# EAGLE design Quad-Thermocouple-Shield (EAGLE 6.1)
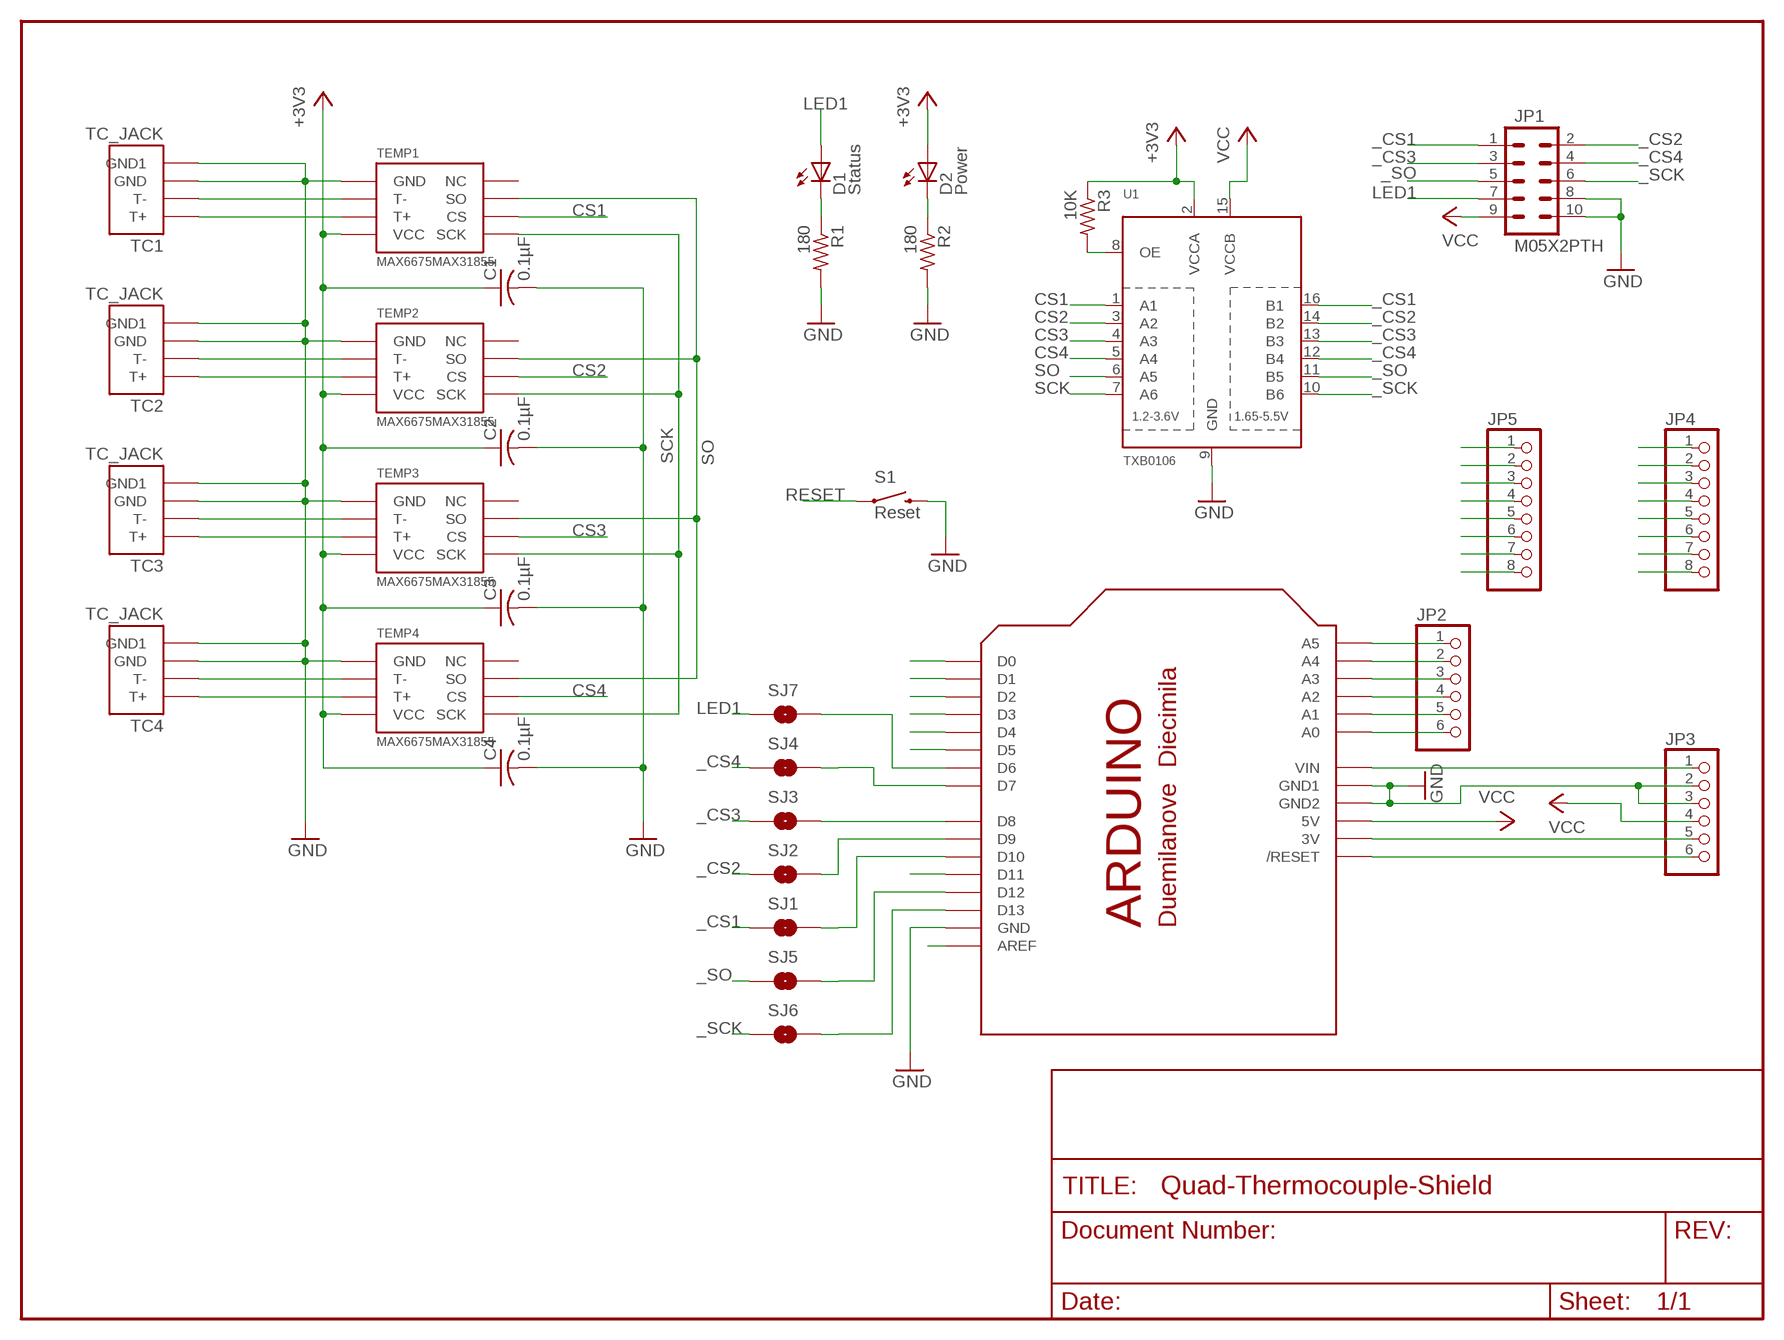
[diagram p0: schematic, sheet 1]

## Parts
C1  0.1µF  C-USC0603  [C0603]
C2  0.1µF  C-USC0603  [C0603]
C3  0.1µF  C-USC0603  [C0603]
C4  0.1µF  C-USC0603  [C0603]
D1  Status  LEDCHIPLED_0805  [CHIPLED_0805]
D2  Power  LEDCHIPLED_0805  [CHIPLED_0805]
JP1  M05X2PTH  [AVR_ICSP]
JP2  PINHD-1X6CB  [1X06-CLEANBIG]
JP3  PINHD-1X6CB  [1X06-CLEANBIG]
JP4  PINHD-1X8CLEANBIG  [1X08-CLEANBIG]
JP5  PINHD-1X8CLEANBIG  [1X08-CLEANBIG]
R1  180  R-US_R0603  [R0603]
R2  180  R-US_R0603  [R0603]
R3  10K  R-US_R0603  [R0603]
S1  Reset  SWITCH-MOMENTARY-2SMD  [TACTILE_SWITCH_SMD]
SJ1  SOLDERJUMPERTRACE  [SJ_2S-TRACE]
SJ2  SOLDERJUMPERTRACE  [SJ_2S-TRACE]
SJ3  SOLDERJUMPERTRACE  [SJ_2S-TRACE]
SJ4  SOLDERJUMPERTRACE  [SJ_2S-TRACE]
SJ5  SOLDERJUMPERTRACE  [SJ_2S-TRACE]
SJ6  SOLDERJUMPERTRACE  [SJ_2S-TRACE]
SJ7  SOLDERJUMPERTRACE  [SJ_2S-TRACE]
TC1  TC_JACK  [TC_JACK]
TC2  TC_JACK  [TC_JACK]
TC3  TC_JACK  [TC_JACK]
TC4  TC_JACK  [TC_JACK]
TEMP1  MAX6675MAX31855  [SOIC-8]
TEMP2  MAX6675MAX31855  [SOIC-8]
TEMP3  MAX6675MAX31855  [SOIC-8]
TEMP4  MAX6675MAX31855  [SOIC-8]
U1  TXB0106  TXB0106PWR  [TSSOP16]
U$3  ARDUINOUNO  [ARDUINO]

## Nets
+3V3: C1.1 C2.1 C3.1 C4.1 D2.A JP3.5 R3.1 TEMP1.VCC TEMP2.VCC TEMP3.VCC TEMP4.VCC U1.2(VCCA) U$3.3V
_CS1: JP1.1 SJ1.1 U1.16(B1)
_CS2: JP1.2 SJ2.1 U1.14(B2)
_CS3: JP1.3 SJ3.1 U1.13(B3)
_CS4: JP1.4 SJ4.1 U1.12(B4)
_SCK: JP1.6 SJ6.1 U1.10(B6)
_SO: JP1.5 SJ5.1 U1.11(B5)
AREF: JP4.8 U$3.AREF
CS1: TEMP1.CS U1.1(A1)
CS2: TEMP2.CS U1.3(A2)
CS3: TEMP3.CS U1.4(A3)
CS4: TEMP4.CS U1.5(A4)
D0: JP5.1 U$3.D0
D1: JP5.2 U$3.D1
D2: JP5.3 U$3.D2
D3: JP5.4 U$3.D3
D4: JP5.5 U$3.D4
D5: JP5.6 U$3.D5
D6: JP5.7 SJ7.2 U$3.D6
D7: JP5.8 SJ4.2 U$3.D7
D8: JP4.1 SJ3.2 U$3.D8
D9: JP4.2 SJ2.2 U$3.D9
D10: JP4.3 SJ1.2 U$3.D10
D11: JP4.4 U$3.D11
D12: JP4.5 SJ5.2 U$3.D12
D13: JP4.6 SJ6.2 U$3.D13
GND: C1.2 C2.2 C3.2 C4.2 JP1.8 JP1.10 JP3.2 JP3.3 JP4.7 R1.2 R2.2 S1.3 TC1.P$1(GND) TC1.P$2(GND1) TC2.P$1(GND) TC2.P$2(GND1) TC3.P$1(GND) TC3.P$2(GND1) TC4.P$1(GND) TC4.P$2(GND1) TEMP1.GND TEMP2.GND TEMP3.GND TEMP4.GND U1.9(GND) U$3.GND U$3.GND1 U$3.GND2
LED1: D1.A JP1.7 SJ7.1
N$2: D1.C R1.1
N$3: JP2.1 U$3.A5
N$6: JP2.2 U$3.A4
N$7: D2.C R2.1
N$9: JP2.3 U$3.A3
N$12: JP2.4 U$3.A2
N$114: R3.2 U1.8(OE)
N$126: JP2.5 U$3.A1
N$127: JP2.6 U$3.A0
N$128: JP3.1 U$3.VIN
RESET: JP3.6 S1.1 U$3.RESET(/RESET)
SCK: TEMP1.SCK TEMP2.SCK TEMP3.SCK TEMP4.SCK U1.7(A6)
SO: TEMP1.SO TEMP2.SO TEMP3.SO TEMP4.SO U1.6(A5)
T1+: TC1.T+ TEMP1.T+
T1-: TC1.T- TEMP1.T-
T2+: TC2.T+ TEMP2.T+
T2-: TC2.T- TEMP2.T-
T3+: TC3.T+ TEMP3.T+
T3-: TC3.T- TEMP3.T-
T4+: TC4.T+ TEMP4.T+
T4-: TC4.T- TEMP4.T-
VCC: JP1.9 JP3.4 U1.15(VCCB) U$3.5V
Unconnected: TEMP1.NC TEMP2.NC TEMP3.NC TEMP4.NC

## Library data of the parts
C1-C4 = resistor:C-US: CAPACITOR, American symbol
D1 D2 = led:LED: LED OSRAM: - CHIPLED LG R971, LG N971, LY N971, LG Q971, LY Q971, LO R971, LY R971 LH N974, LH R974 LS Q976, LO Q976, LY Q976 LO Q996 - Hyper CHIPLED LW Q18S LB Q993, LB Q99A, LB R99A - SideLED LS A670, LO A670, LY A670, LG A670, LP A670 LB A673, LV A673, LT A673, LW A673 LH A674 LY A675 LS A676, LA A676, LO A676, LY A676, LW A676 LS A679, LY A679, LG A679 - Hyper Micro SIDELED® LS Y876, LA Y876, LO Y876, LY Y876 LT Y87S - SmartLED LW L88C, LW L88S LB L89C, LB L89S, LG L890 LS L89K, LO L89K, LY L89K LS L896, LA L896, LO L896, LY L896 - TOPLED LS T670, LO T670, LY T670, LG T670, LP T670 LSG T670, LSP T670, LSY T670, LOP T670, LYG T670 LG T671, LOG T671, LSG T671 LB T673, LV T673, LT T673, LW T673 LH T674 LS T676, LA T676, LO T676, LY T676, LB T676, LH T676, LSB T676, LW T676 LB T67C, LV T67C, LT T67C, LS T67K, LO T67K, LY T67K, LW E67C LS E67B, LA E67B, LO E67B, LY E67B, LB E67C, LV E67C, LT E67C LW T67C LS T679, LY T679, LG T679 LS T770, LO T770, LY T770, LG T770, LP T770 LB T773, LV T773, LT T773, LW T773 LH T774 LS E675, LA E675, LY E675, LS T675 LS T776, LA T776, LO T776, LY T776, LB T776 LHGB T686 LT T68C, LB T68C - Hyper Mini TOPLED® LB M676 - Mini TOPLED Santana® LG M470 LS M47K, LO M47K, LY M47K Source: http://www.osram.convergy.de LUXEON: - LUMILED® LXK2-PW12-R00, LXK2-PW12-S00, LXK2-PW14-U00, LXK2-PW14-V00 LXK2-PM12-R00, LXK2-PM12-S00, LXK2-PM14-U00 LXK2-PE12-Q00, LXK2-PE12-R00, LXK2-PE12-S00, LXK2-PE14-T00, LXK2-PE14-U00 LXK2-PB12-K00, LXK2-PB12-L00, LXK2-PB12-M00, LXK2-PB14-N00, LXK2-PB14-P00, LXK2-PB14-Q00 LXK2-PR12-L00, LXK2-PR12-M00, LXK2-PR14-Q00, LXK2-PR14-R00 LXK2-PD12-Q00, LXK2-PD12-R00, LXK2-PD12-S00 LXK2-PH12-R00, LXK2-PH12-S00 LXK2-PL12-P00, LXK2-PL12-Q00, LXK2-PL12-R00 Source: www.luxeon.com KINGBRIGHT: KA-3528ASYC Source: www.kingbright.com
JP1 = SparkFun:M05X2: Header 5x2 Standard 10-pin dual row 0.1" header. Commonly used with AVR-ISP. Use with Spark Fun Electronics SKU: PRT-00778
JP2 JP3 = adafruit:PINHD-1X6: PIN HEADER
JP4 JP5 = adafruit:PINHD-1X8: PIN HEADER
R1-R3 = resistor:R-US_: RESISTOR, American symbol
S1 = SparkFun:SWITCH-MOMENTARY-2
SJ1-SJ7 = SparkFun:SOLDERJUMPER: Solder Jumper Standard SMD solder jumper. Used to automate production. Two varients : Normally Open and Normally Closed are the same, but have different paste layers. NC will have a large amount of paste and should jumper during reflow.
TC1-TC4 = McLEng:TC_JACK
TEMP1-TEMP4 = McLEng:MAX6675
U1 = McLEng:TXB0106PWR: 6-Bit Bi-Directional Level Shifter 1.2V-3.6V (VCCA) to 1.65V-5.5V (VCCB) bi-directional level shifter with auto direction sensing. Max data rate - VCCA 1.8V: 20Mbps (50ns), VCCA 3.3V: 100Mbps (10ns) Digikey: 296-23759-1-ND
U$3 = adafruit:ARDUINO: Arduino Diecimila/Duemilanove Make a shield with ease, this package has all the named pins as well as the two mounting drill holes and an outline of the USB and DC power connector. The outline is on the DIMENSION layer, so if your board house uses it they will cut the outline to match. http://www.ladyada.net/library/pcb/eaglelibrary.html

## Board
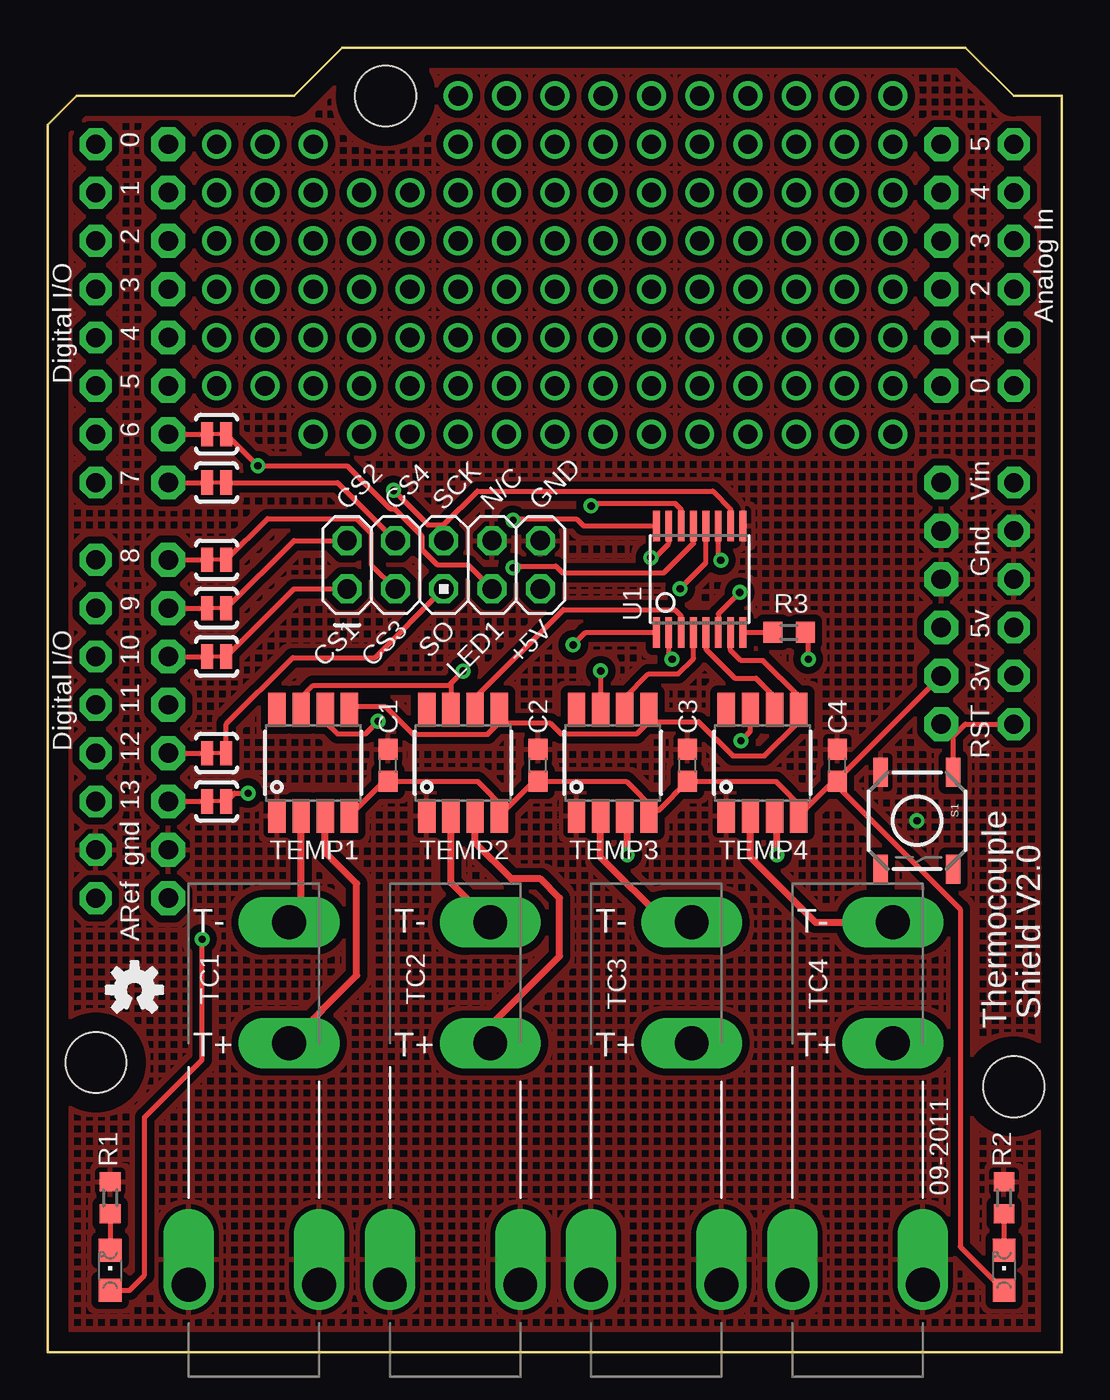
[diagram p1: board, top side]
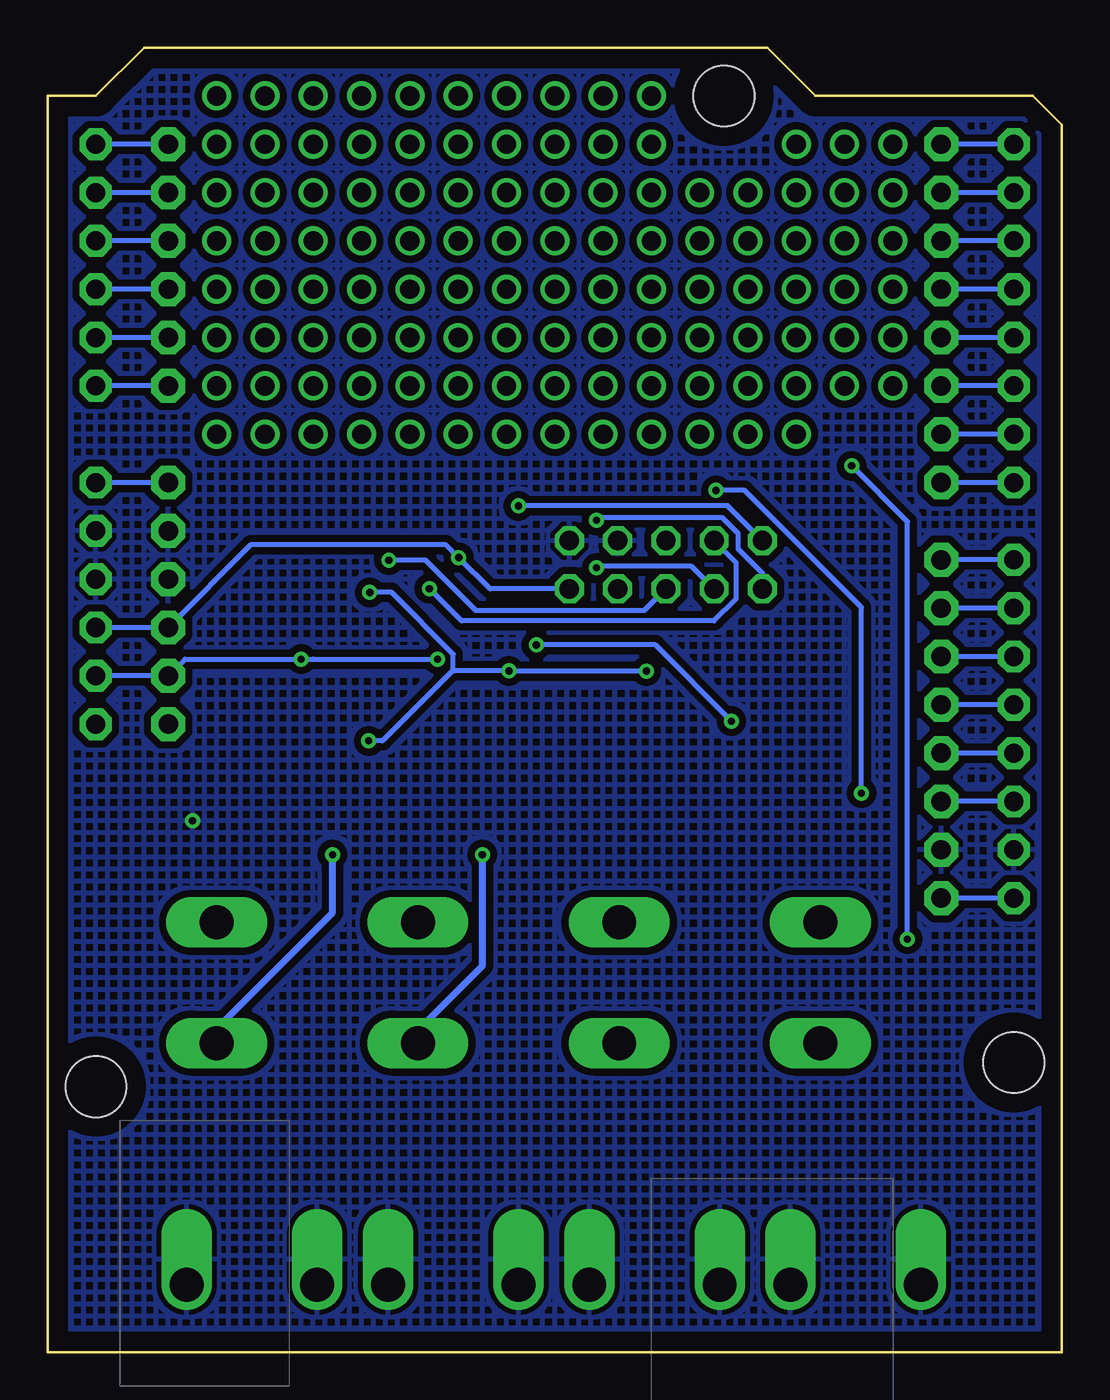
[diagram p2: board, bottom side, seen from below]

Size 53.34 x 68.58 mm. Coordinates in mm from the lower left corner, seen from the top.
Outline: 0,0 53.34,0 53.34,66.04 50.8,66.04 48.26,68.58 15.49,68.58 12.95,66.04 1.52,66.04 0,64.52 0,0
Copper layers (1*16): Top 0.035mm / dielectric 1.5mm / Bottom 0.035mm
Design rules: minimum track width 10mil, minimum drill 15mil, track to track 10mil, track to pad 10mil, pad to pad 8mil, via to via 10mil, smd to smd 8mil, copper to edge 40mil, drill to drill 10mil, minimum pad ring 10mil, minimum via ring 8mil, stop-mask expansion 4mil, vias tented up to drill 25mil, thermal gap 10mil
tRestrict: area 0,22.9 to 0.6,64.8; area 52.7,31.8 to 53.3,66
bRestrict: area 0,22.9 to 0.6,64.8; area 52.7,31.8 to 53.3,66

### Footprints (pad centres in the part's own frame; a part is rotated, then mirrored left to right if it is on the bottom)
C0603 = smd 1.1 x 1: 1 -0.85,0; 2 0.85,0
CHIPLED_0805 = smd 1.2 x 1.2: A 0,-1.05; C 0,1.05
AVR_ICSP = drill 1.016 octagon: 1 -1.27,5.08; 2 1.27,5.08; 3 -1.27,2.54; 4 1.27,2.54; 5 -1.27,0; 6 1.27,0; 7 -1.27,-2.54; 8 1.27,-2.54; 9 -1.27,-5.08; 10 1.27,-5.08
1X06-CLEANBIG = drill 1.016 pad 1.778 octagon: 1 -6.35,0; 2 -3.81,0; 3 -1.27,0; 4 1.27,0; 5 3.81,0; 6 6.35,0
1X08-CLEANBIG = drill 1.016 pad 1.778 octagon: 1 -8.89,0; 2 -6.35,0; 3 -3.81,0; 4 -1.27,0; 5 1.27,0; 6 3.81,0; 7 6.35,0; 8 8.89,0
R0603 = smd 1 x 1.1: 1 -0.85,0; 2 0.85,0
TACTILE_SWITCH_SMD = smd 1.524 x 0.762: 1 -2.54,1.905; 2 2.54,1.905; 3 -2.54,-1.905; 4 2.54,-1.905
SJ_2S-TRACE = smd 0.635 x 1.27: 1 -0.508,0; 2 0.508,0
TC_JACK = drill 1.778 offset: P$1 -5.283,0; P$2 1.575,0 | drill 1.778 long: T+ 0,12.7; T- 0,19.05
SOIC-8 = smd 1.778 x 0.914: CS 2.794,-0.635; GND -2.794,1.905; NC 2.794,1.905; SCK 2.794,-1.905; SO 2.794,0.635; T+ -2.794,-0.635; T- -2.794,0.635; VCC -2.794,-1.905
TSSOP16 = smd 0.35 x 1.6: 1 -2.275,-2.8; 2 -1.625,-2.8; 3 -0.975,-2.8; 4 -0.325,-2.8; 5 0.325,-2.8; 6 0.975,-2.8; 7 1.625,-2.8; 8 2.275,-2.8; 9 2.275,2.8; 10 1.625,2.8; 11 0.975,2.8; 12 0.325,2.8; 13 -0.325,2.8; 14 -0.975,2.8; 15 -1.625,2.8; 16 -2.275,2.8
ARDUINO = drill 1 pad 1.676 octagon: 3V 35.56,2.54; 5V 38.1,2.54; A0 50.8,2.54; A1 53.34,2.54; A2 55.88,2.54; A3 58.42,2.54; A4 60.96,2.54; A5 63.5,2.54; AREF 23.876,50.8; D0 63.5,50.8; D1 60.96,50.8; D2 58.42,50.8; D3 55.88,50.8; D4 53.34,50.8; D5 50.8,50.8; D6 48.26,50.8; D7 45.72,50.8; D8 41.656,50.8; D9 39.116,50.8; D10 36.576,50.8; D11 34.036,50.8; D12 31.496,50.8; D13 28.956,50.8; GND 26.416,50.8; GND1 43.18,2.54; GND2 40.64,2.54; RESET 33.02,2.54; VIN 45.72,2.54 | hole 3.2: 15.24,50.8; 66.04,35.56; 13.97,2.54

### Placement (x,y rotation side)
C1  17.91,30.86 90 top
C2  25.78,30.86 90 top
C3  33.66,30.86 90 top
C4  41.53,30.86 90 top
D1  3.3,4.32 0 top
D2  50.29,4.32 0 top
JP1  20.83,41.4 90 top
JP2  46.99,57.15 270 top
JP3  46.99,39.37 270 top
JP4  6.35,32.77 270 top
JP5  6.35,54.61 270 top
R1  3.3,8.13 90 top
R2  50.29,8.13 90 top
R3  38.99,37.85 180 top
S1  45.72,27.94 270 top
SJ1  8.89,36.58 180 top
SJ2  8.89,39.12 180 top
SJ3  8.89,41.66 180 top
SJ4  8.89,45.72 180 top
SJ5  8.89,31.5 180 top
SJ6  8.89,28.96 180 top
SJ7  8.89,48.26 180 top
TC1  12.7,3.56 0 top
TC2  23.28,3.56 0 top
TC3  33.87,3.56 0 top
TC4  44.45,3.56 0 top
TEMP1  13.97,30.99 90 top
TEMP2  21.84,30.99 90 top
TEMP3  29.72,30.99 90 top
TEMP4  37.59,30.99 90 top
U1  34.29,40.64 0 top
U$2  [OSHW-LOGO-S]  4.57,19.05 0 top
U$3  53.34,0 90 top

### Tracks (layer width: path | path; a pad name or v marks a point on that pad's centre or on a via)
+3V3  (via drill 0.38, 0.38 pad 0.79)
  Top 0.254: 41.42,29.86 47.99,23.29 47.99,5.57 D2.A | 41.42,29.86 41.42,29.9 C4.1 41.53,30.1 JP3.5 | 41.42,29.86 41.16,29.86 39.81,28.5 | 39.81,28.5 TEMP4.VCC | 39.81,28.5 38.3,30.01 C3.1 32.15,28.51 31.94,28.51 | 24.09,28.54 TEMP2.VCC | 24.09,28.54 25.57,30.01 C2.1 30.43,30.01 31.94,28.51 | 24.09,28.54 22.61,30.01 C1.1 17.69,30.01 TEMP1.VCC | U1.2 32.66,36.61 v32.84,36.44 | 31.94,28.51 TEMP3.VCC | R3.1 40.01,37.85 v40.01,36.44
  Bottom 0.254: JP3.5 U$3.3V | 46.11,36.44 v40.01,36.44 | v40.01,36.44 39.37,36.44 | 39.37,36.44 v32.84,36.44 | JP3.5 46.11,36.44 | 46.11,36.44 v40.01,36.44 | v40.01,36.44 39.37,36.44 | JP3.5 46.11,36.44 | 46.11,36.44 v40.01,36.44 | JP3.5 46.11,36.44
_CS1  (via drill 0.38 pad 0.79)
  Top 0.254: U1.16 28.18,43.44 27.81,43.81 24.55,43.81 v24.47,43.73 | SJ1.1 12.95,40.13 JP1.1
  Bottom 0.254: v24.47,43.73 24.34,43.86 17.84,43.86 17.02,43.03 17.02,42.22 15.75,40.95 JP1.1
_CS2  (via drill 0.38 pad 0.79)
  Top 0.254: JP1.2 12.95,42.67 SJ2.1 | U1.14 33.31,44.3 32.99,44.62 28.72,44.62 v28.58,44.49
  Bottom 0.254: v28.58,44.49 28.57,44.51 17.58,44.51 JP1.2
_CS3  (via drill 0.38 pad 0.79)
  Top 0.254: v24.47,41.23 24.56,41.32 26.73,41.32 27.09,40.97 32.41,40.97 33.97,42.52 U1.13 | JP1.3 17.02,41.4 17.02,43.04 16.24,43.82 11.56,43.82 SJ3.1
  Bottom 0.254: JP1.3 19.47,41.32 24.39,41.32 v24.47,41.23
_CS4  (via drill 0.38 pad 0.79)
  Top 0.254: U1.12 34.62,41.49 v33.26,40.14 | JP1.4 15.24,45.72 SJ4.1
  Bottom 0.254: v33.26,40.14 31.57,38.45 18.29,38.45 17.14,39.59 17.14,41.53 JP1.4
_SCK  (via drill 0.38 pad 0.79)
  Top 0.254: U1.10 35.91,44.33 34.98,45.27 22.6,45.27 20.83,43.5 | 20.83,43.5 20,43.5 v18.19,45.31 | 20.83,43.5 JP1.6 | v10.54,29.39 9.84,29.39 SJ6.1
  Bottom 0.254: v18.19,45.31 16.69,45.31 10.54,39.16 v10.54,29.39
_SO  (via drill 0.38 pad 0.79)
  Top 0.254: JP1.5 17.22,36.52 12.89,36.52 9.4,33.03 SJ5.1 | U1.11 35.27,41.77 v35.4,41.63
  Bottom 0.254: v35.4,41.63 33.47,41.63 30.82,38.98 21.98,38.98 JP1.5
AREF
  Bottom 0.254: U$3.AREF JP4.8
CS1  (via drill 0.38 pad 0.79)
  Top 0.254: v17.38,33.18 16.71,32.51 15.25,32.51 14.61,33.15 TEMP1.CS | U1.1 28.3,37.84 v27.64,37.18
  Bottom 0.254: v27.64,37.18 21.39,37.18 v17.38,33.18
CS2
  Top 0.254: U1.3 33.31,38.71 32.98,39.04 27.13,39.04 22.48,34.4 TEMP2.CS
CS3
  Top 0.254: TEMP3.CS 30.35,34.42 31.6,35.66 33.16,35.66 33.97,36.47 U1.4
CS4
  Top 0.254: U1.5 34.62,36.96 36.14,35.44 37.26,35.44 38.23,34.47 TEMP4.CS
D0
  Bottom 0.254: U$3.D0 JP5.1
D1
  Bottom 0.254: U$3.D1 JP5.2
D2
  Bottom 0.254: U$3.D2 JP5.3
D3
  Bottom 0.254: U$3.D3 JP5.4
D4
  Bottom 0.254: U$3.D4 JP5.5
D5
  Bottom 0.254: U$3.D5 JP5.6
D6
  Top 0.254: JP5.7 SJ7.2
  Bottom 0.254: U$3.D6 JP5.7
D7
  Top 0.254: JP5.8 SJ4.2
  Bottom 0.254: U$3.D7 JP5.8
D8
  Top 0.254: JP4.1 SJ3.2
  Bottom 0.254: U$3.D8 JP4.1
D9
  Top 0.254: JP4.2 SJ2.2
  Bottom 0.254: U$3.D9 JP4.2
D10
  Top 0.254: JP4.3 SJ1.2
  Bottom 0.254: U$3.D10 JP4.3
D11
  Bottom 0.254: U$3.D11 JP4.4
D12
  Top 0.254: JP4.5 SJ5.2
  Bottom 0.254: U$3.D12 JP4.5
D13
  Top 0.254: JP4.6 SJ6.2
  Bottom 0.254: U$3.D13 JP4.6
GND  (via drill 0.38 pad 0.79)
  other vias: 45.72,27.94
  pour Bottom (isolate 0.381, hatched): 0,0 53.34,0 53.34,66.04 50.8,66.04 48.26,68.58 15.49,68.58 12.95,66.04 1.52,66.04 0,64.52
  pour Top (isolate 0.381, hatched): 0,0 53.34,0 53.34,66.04 50.8,66.04 48.26,68.58 15.49,68.58 12.95,66.04 1.52,66.04 0,64.52
LED1  (via drill 0.38 pad 0.79)
  Top 0.254: v11.06,46.6 SJ7.1 | v11.06,46.6 11.43,46.6 | 11.43,46.6 15.76,46.6 18,44.35 18.24,44.35 19.68,42.91 19.68,42.2 20.48,41.4 22.1,41.4 JP1.7 | D1.A 4.31,3.27 5.1,4.06 5.1,12.37 8.12,15.38 8.12,21.71 v8.13,21.72 | v11.06,46.6 11.43,46.6
  Bottom 0.254: v8.13,21.72 8.13,43.67 v11.06,46.6
N$1  (via drill 1.02)
  other vias: 11.43,50.8
N$2
  Top 0.254: R1.1 D1.C
N$3
  Bottom 0.254: JP2.1 U$3.A5
N$4  (via drill 1.02)
  other vias: 13.97,50.8
N$5  (via drill 1.02)
  other vias: 16.51,50.8
N$6
  Bottom 0.254: JP2.2 U$3.A4
N$7
  Top 0.254: R2.1 D2.C
N$8  (via drill 1.02)
  other vias: 19.05,50.8
N$9
  Bottom 0.254: JP2.3 U$3.A3
N$10  (via drill 1.02)
  other vias: 21.59,50.8
N$11  (via drill 1.02)
  other vias: 24.13,50.8
N$12
  Bottom 0.254: JP2.4 U$3.A2
N$13  (via drill 1.02)
  other vias: 26.67,50.8
N$14  (via drill 1.02)
  other vias: 29.21,50.8
N$15  (via drill 1.02)
  other vias: 31.75,50.8
N$16  (via drill 1.02)
  other vias: 34.29,50.8
N$17  (via drill 1.02)
  other vias: 36.83,50.8
N$18  (via drill 1.02)
  other vias: 39.37,50.8
N$19  (via drill 1.02)
  other vias: 41.91,50.8
N$20  (via drill 1.02)
  other vias: 44.45,50.8
N$21  (via drill 1.02)
  other vias: 11.43,53.34
N$22  (via drill 1.02)
  other vias: 13.97,53.34
N$23  (via drill 1.02)
  other vias: 16.51,53.34
N$24  (via drill 1.02)
  other vias: 19.05,53.34
N$25  (via drill 1.02)
  other vias: 21.59,53.34
N$26  (via drill 1.02)
  other vias: 24.13,53.34
N$27  (via drill 1.02)
  other vias: 26.67,53.34
N$28  (via drill 1.02)
  other vias: 29.21,53.34
N$29  (via drill 1.02)
  other vias: 31.75,53.34
N$30  (via drill 1.02)
  other vias: 34.29,53.34
N$31  (via drill 1.02)
  other vias: 36.83,53.34
N$32  (via drill 1.02)
  other vias: 39.37,53.34
N$33  (via drill 1.02)
  other vias: 41.91,53.34
N$34  (via drill 1.02)
  other vias: 44.45,53.34
N$35  (via drill 1.02)
  other vias: 11.43,55.88
N$36  (via drill 1.02)
  other vias: 13.97,55.88
N$37  (via drill 1.02)
  other vias: 16.51,55.88
N$38  (via drill 1.02)
  other vias: 19.05,55.88
N$39  (via drill 1.02)
  other vias: 21.59,55.88
N$40  (via drill 1.02)
  other vias: 24.13,55.88
N$41  (via drill 1.02)
  other vias: 26.67,55.88
N$42  (via drill 1.02)
  other vias: 29.21,55.88
N$43  (via drill 1.02)
  other vias: 31.75,55.88
N$44  (via drill 1.02)
  other vias: 34.29,55.88
N$45  (via drill 1.02)
  other vias: 36.83,55.88
N$46  (via drill 1.02)
  other vias: 39.37,55.88
N$47  (via drill 1.02)
  other vias: 41.91,55.88
N$48  (via drill 1.02)
  other vias: 44.45,55.88
N$49  (via drill 1.02)
  other vias: 11.43,58.42
N$50  (via drill 1.02)
  other vias: 13.97,58.42
N$51  (via drill 1.02)
  other vias: 16.51,58.42
N$52  (via drill 1.02)
  other vias: 19.05,58.42
N$53  (via drill 1.02)
  other vias: 21.59,58.42
N$54  (via drill 1.02)
  other vias: 24.13,58.42
N$55  (via drill 1.02)
  other vias: 26.67,58.42
N$56  (via drill 1.02)
  other vias: 29.21,58.42
N$57  (via drill 1.02)
  other vias: 31.75,58.42
N$58  (via drill 1.02)
  other vias: 34.29,58.42
N$59  (via drill 1.02)
  other vias: 36.83,58.42
N$60  (via drill 1.02)
  other vias: 39.37,58.42
N$61  (via drill 1.02)
  other vias: 41.91,58.42
N$62  (via drill 1.02)
  other vias: 44.45,58.42
N$63  (via drill 1.02)
  other vias: 11.43,60.96
N$64  (via drill 1.02)
  other vias: 13.97,60.96
N$65  (via drill 1.02)
  other vias: 16.51,60.96
N$66  (via drill 1.02)
  other vias: 19.05,60.96
N$67  (via drill 1.02)
  other vias: 21.59,60.96
N$68  (via drill 1.02)
  other vias: 24.13,60.96
N$69  (via drill 1.02)
  other vias: 26.67,60.96
N$70  (via drill 1.02)
  other vias: 29.21,60.96
N$71  (via drill 1.02)
  other vias: 31.75,60.96
N$72  (via drill 1.02)
  other vias: 34.29,60.96
N$73  (via drill 1.02)
  other vias: 36.83,60.96
N$74  (via drill 1.02)
  other vias: 39.37,60.96
N$75  (via drill 1.02)
  other vias: 41.91,60.96
N$76  (via drill 1.02)
  other vias: 44.45,63.5
N$77  (via drill 1.02)
  other vias: 11.43,63.5
N$78  (via drill 1.02)
  other vias: 13.97,63.5
N$79  (via drill 1.02)
  other vias: 8.89,50.8
N$80  (via drill 1.02)
  other vias: 8.89,53.34
N$81  (via drill 1.02)
  other vias: 21.59,63.5
N$82  (via drill 1.02)
  other vias: 24.13,63.5
N$83  (via drill 1.02)
  other vias: 26.67,63.5
N$84  (via drill 1.02)
  other vias: 29.21,63.5
N$85  (via drill 1.02)
  other vias: 31.75,63.5
N$86  (via drill 1.02)
  other vias: 34.29,63.5
N$87  (via drill 1.02)
  other vias: 36.83,63.5
N$88  (via drill 1.02)
  other vias: 39.37,63.5
N$89  (via drill 1.02)
  other vias: 41.91,63.5
N$90  (via drill 1.02)
  other vias: 8.89,55.88
N$91  (via drill 1.02)
  other vias: 8.89,58.42
N$92  (via drill 1.02)
  other vias: 24.13,66.04
N$93  (via drill 1.02)
  other vias: 26.67,66.04
N$94  (via drill 1.02)
  other vias: 29.21,66.04
N$95  (via drill 1.02)
  other vias: 31.75,66.04
N$96  (via drill 1.02)
  other vias: 34.29,66.04
N$97  (via drill 1.02)
  other vias: 36.83,66.04
N$98  (via drill 1.02)
  other vias: 39.37,66.04
N$99  (via drill 1.02)
  other vias: 41.91,66.04
N$100  (via drill 1.02)
  other vias: 8.89,60.96
N$101  (via drill 1.02)
  other vias: 8.89,63.5
N$102  (via drill 1.02)
  other vias: 21.59,66.04
N$103  (via drill 1.02)
  other vias: 13.97,48.26
N$104  (via drill 1.02)
  other vias: 21.59,48.26
N$105  (via drill 1.02)
  other vias: 24.13,48.26
N$106  (via drill 1.02)
  other vias: 26.67,48.26
N$107  (via drill 1.02)
  other vias: 29.21,48.26
N$108  (via drill 1.02)
  other vias: 31.75,48.26
N$109  (via drill 1.02)
  other vias: 34.29,48.26
N$110  (via drill 1.02)
  other vias: 36.83,48.26
N$111  (via drill 1.02)
  other vias: 39.37,48.26
N$112  (via drill 1.02)
  other vias: 41.91,48.26
N$113  (via drill 1.02)
  other vias: 44.45,48.26
N$114
  Top 0.254: U1.8 R3.2
N$122  (via drill 1.02)
  other vias: 16.51,48.26
N$123  (via drill 1.02)
  other vias: 19.05,48.26
N$124  (via drill 1.02)
  other vias: 44.45,66.04
N$125  (via drill 1.02)
  other vias: 44.45,60.96
N$126
  Bottom 0.254: JP2.5 U$3.A1
N$127
  Bottom 0.254: JP2.6 U$3.A0
N$128
  Bottom 0.254: JP3.1 U$3.VIN
RESET
  Top 0.254: S1.1 47.62,32.38 | 47.62,32.38 JP3.6 | U$3.RESET 48.26,33.02 47.62,32.38
SCK
  Top 0.254: 31.62,33.16 30.98,32.51 27,32.51 26.41,33.09 23.75,33.09 | 31.62,33.16 TEMP3.SCK | 31.62,33.16 34.23,33.16 36.03,31.35 37.7,31.35 39.5,33.14 TEMP4.SCK 39.5,34.48 37.62,36.36 36.47,36.36 35.91,36.92 U1.7 | 23.75,33.09 23.14,32.48 19.21,32.48 17.74,33.95 16.05,33.95 TEMP1.SCK | 23.75,33.09 TEMP2.SCK
SO  (via drill 0.38 pad 0.79)
  Top 0.254: v21.85,35.81 21.21,35.17 21.21,35.05 | TEMP3.SO v29.08,35.81 v29.08,35.82 | 21.21,35.05 TEMP2.SO | TEMP1.SO 13.34,34.41 13.98,35.05 21.21,35.05 | U1.6 35.27,38.81 v36.4,39.94 | v36.46,32.14 36.96,32.64 TEMP4.SO
  Bottom 0.254: v21.85,35.81 v29.08,35.81 v29.08,35.82 31.96,35.82 32.01,35.86 | v36.4,39.94 35.24,39.94 32.01,36.7 32.01,35.86 | 32.01,35.86 35.72,32.14 v36.46,32.14
T1+
  Top 0.381: TEMP1.T+ 14.61,26.29 16.26,24.64 16.26,19.81 TC1.T+
T1-
  Top 0.381: TEMP1.T- 13.34,23.24 TC1.T-
T2+
  Top 0.381: TC2.T+ 23.28,17.19 26.92,20.83 26.92,23.88 25.91,24.89 24.38,24.89 22.48,26.8 TEMP2.T+
T2-
  Top 0.381: TEMP2.T- 21.21,24.68 TC2.T-
T3+  (via drill 0.38 pad 0.79)
  Top 0.381: v30.48,26.16 30.48,28.07 TEMP3.T+
  Bottom 0.381: TC3.T+ 33.87,16.93 30.48,20.32 v30.48,26.16
T3-
  Top 0.381: TEMP3.T- 29.08,26.04 32.51,22.61 TC3.T-
T4+  (via drill 0.38 pad 0.79)
  Top 0.381: v38.35,26.16 38.35,28.07 TEMP4.T+
  Bottom 0.381: TC4.T+ 44.45,17.02 38.35,23.11 v38.35,26.16
T4-
  Top 0.381: TEMP4.T- 36.96,26.04 40.39,22.61 TC4.T-
VCC  (via drill 0.38 pad 0.79)
  Top 0.254: U1.15 32.66,42.5 31.94,41.78 v31.72,41.78
  Bottom 0.254: U$3.5V JP3.4 42.65,42.44 32.38,42.44 v31.72,41.78 30.07,40.13 JP1.9

### Text on the board
tPlace: Shield V2.0 | Thermocouple | 09-2011
tNames: CS2 | CS4 | SCK | N/C | GND | CS1 | CS3 | SO | LED1 | +5V